# Altium project DCtoAC.PrjPcb
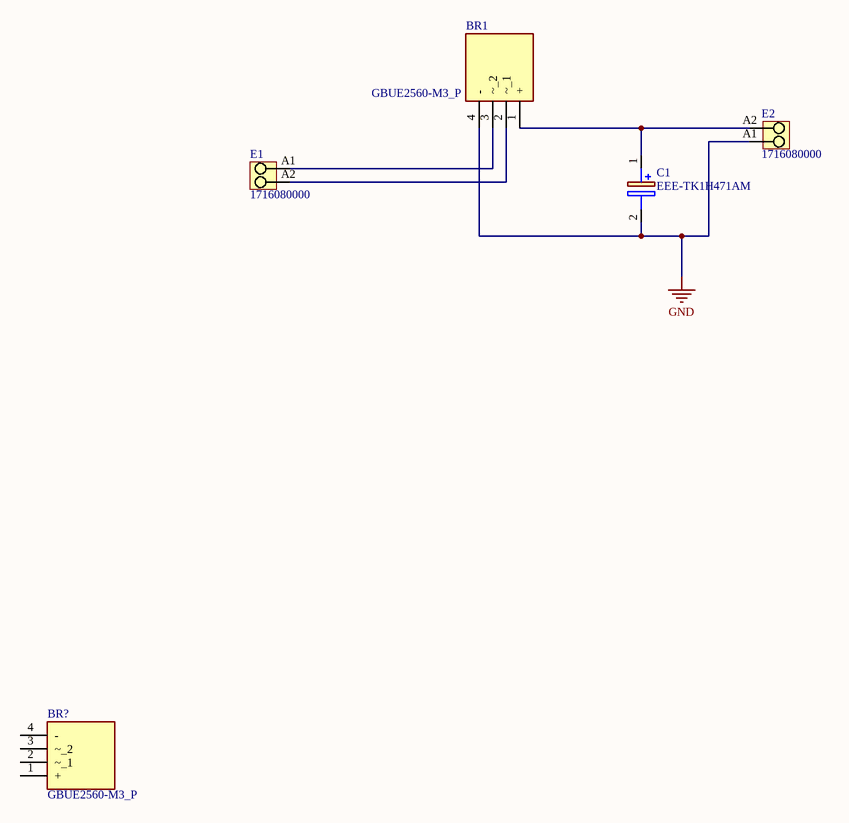
[diagram p0: DCtoAC.SchDoc]
1 sheet, 5 parts. Net scope: global (net labels, ports and power ports of the same name join across sheets).
Board file: DCtoAC.PcbDoc

## Sheet DCtoAC.SchDoc: AC to DC
size A4; DrawnBy: Dilun Sandeepa/Navindu Dissanayake; Organization: Altium Limited; Address1: L3, 12a Rodborough Rd; Address2: Frenchs Forest; Address3: NSW; Address4: Australia 2086; DocumentNumber: .; Revision: 1.1; SheetNumber: 1; SheetTotal: 1

### Parts
BR1  GBUE2560-M3_P  [GBUE2560M3P]
BR?  GBUE2560-M3_P  [GBUE2560M3P]
C1  EEE-TK1H471AM  [EEEFK0J682AM]
E1  1716080000  [LM_5_08_90_02]
E2  1716080000  [LM_5_08_90_02]

### Nets
GND: BR1.4(-) C1.2(-) E2.A1
NetBR1_1: BR1.1(+) C1.1(+) E2.A2
NetBR1_2: BR1.2(~_1) E1.A2
NetBR1_3: BR1.3(~_2) E1.A1

Not connected (* = marked no-connect by the designer): BR? 1(+) 2(~_1) 3(~_2) 4(-)

### Notes on the sheet
- Title
- Size:
- Date:
- A4
- Number:
- Time:
- Revision:
- Sheet
- of
- File:

### Library data of the parts
BR1 BR? = GBUE2560-M3_P: Bridge Rectifier; Manufacturer_Name: Vishay; Manufacturer_Part_Number: GBUE2560-M3/P; Datasheet Link: https://componentsearchengine.com//GBUE2560-M3_P.pdf; Height: 18.55mm; Mouser2 Part Number: 78-GBUE2560-M3/P; Mouser2 Price/Stock: https://www.mouser.com/Search/Refine.aspx?Keyword=78-GBUE2560-M3%2FP
C1 = EEE-TK1H471AM: Capacitor Polarised; Manufacturer_Name: Panasonic; Datasheet Link: http://industrial.panasonic.com/cdbs/www-data/pdf/RDE0000/ABA0000C1190.pdf; Height: 17mm; Manufacturer_Part_Number: EEE-TK1H471AM
E1 E2 = CMP-1559-01766-1: OMNIMATE Signal - series LM; Manufacturer: Weidmueller; Solder_pin_length_mm: 3,5 mm; Solid_max_H05_07_V_U: 2,5 mm²; Contact_material: Cu-Leg; No_of_poles: 2; Mounting_onto_the_PCB: Solder connection; Contact_surface: tinned; Wire_cross_section_AWG_max_UL_1059: AWG 14; Rated_voltage_for_surge_voltage_class_pollution_degree_II_2: 630 V; Side_termination_characteristic: closed side; UL_94_flammability_rating: V-0; Wire_cross_section_AWG_min_UL_1059: AWG 24; Pitch_mm: 5,08 mm; Pitch_inch: 0,2 inch; Rated_voltage_use_group_B_UL_1059: 300 V; Solid_min_H05_07_V_U: 0,2 mm²; Short_text_for_material: LM 5.08/02/90 3.5SN OR BX; Insulating_material: Wemid (PA); Rated_current_use_group_B_UL_1059: 15 A; PartNumber: 1716080000; Colour: Orange; ComponentLink1URL: http://www.weidmueller.com/; ComponentLink1Description: Manufacturer URL; Revision: V1; Qty: 500 PCS; ComponentLink2Description: URL Link1; ComponentLink2URL: http://catalog.weidmueller.com/catalog/Start.do?localeId=en&ObjectID=1716080000; Packaging: Box; PackageReference: LM_5_08_90_02